# Altium schematic sheet -200mV_Reference_Voltage.SchDoc
size A4
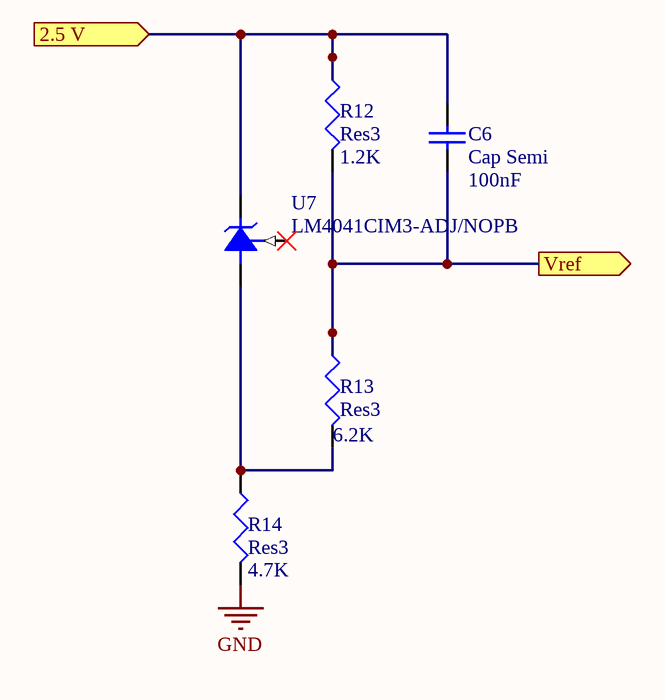
[diagram p0: -200mV_Reference_Voltage.SchDoc]

## Parts
C6  Cap Semi  value 100nF  [C1206]
R12  Res3  value 1.2K  [J1-0603]
R13  Res3  value 6.2K  [J1-0603]
R14  Res3  value 4.7K  [J1-0603]
U7  LM4041CIM3-ADJ/NOPB  [MF03A_M]

## Ports
2.5 V (in), Vref (out)

## Nets
GND: R14.1
2.5 V: C6.1 R12.2 U7.2(+V) ; port 2.5 V
Vref: C6.2 R12.1 R13.2 ; port Vref
NetR13_1: R13.1 R14.2 U7.3(-V)

Not connected (* = marked no-connect by the designer): U7 1(FB)*

## Library data of the parts
C6 = Cap Semi: Capacitor (Semiconductor SIM Model); Published: 8-Jun-2000; PackageReference: C1206; Publisher: Altium Limited; PackageDescription: Chip Capacitor; LatestRevisionDate: 29-May-2009; LatestRevisionNote: IPC-7351 Footprint Added.
R12-R14 = Res3: Resistor; Published: 8-Jun-2000; LatestRevisionDate: 29-May-2009; LatestRevisionNote: IPC-7351 Footprint Added.; PackageReference: J1-0603; Publisher: Altium Limited; PackageDescription: Chip Resistor
U7 = CMP-0074-00728-2: Precision Micropower Shunt Voltage Reference, 3-pin SOT-23, Pb-Free; Manufacturer: National Semiconductor; PowerWise: N; CompType: Voltage Reference IC; PackageTopMarking: RAC*XTT; DatasheetVersion: Mar-2005; PackageVersion: revB, Mar-2003; ComponentLink1URL: http://www.national.com/ds/LM/LM4041.pdf; RevisionNote: Component URLs added; RoHS: Y; PackageDescription: Molded SOT-23, .115 x .051 x .037in Body, 3 Lead, .075 in Pitch; ComponentLink1Description: LM4041 Datasheet; PackageReference: MF03A; ComponentLink2URL: http://www.national.com/pf/LM/LM4041.html; ComponentLink3URL: http://www.national.com/packaging/folders/mf03a.html; ComponentLink2Description: LM4041 Web Page; PinCount: 3; ComponentLink3Description: MF03A Package Page